# EAGLE design Grove - Recorder v1.0 (EAGLE 6.4)
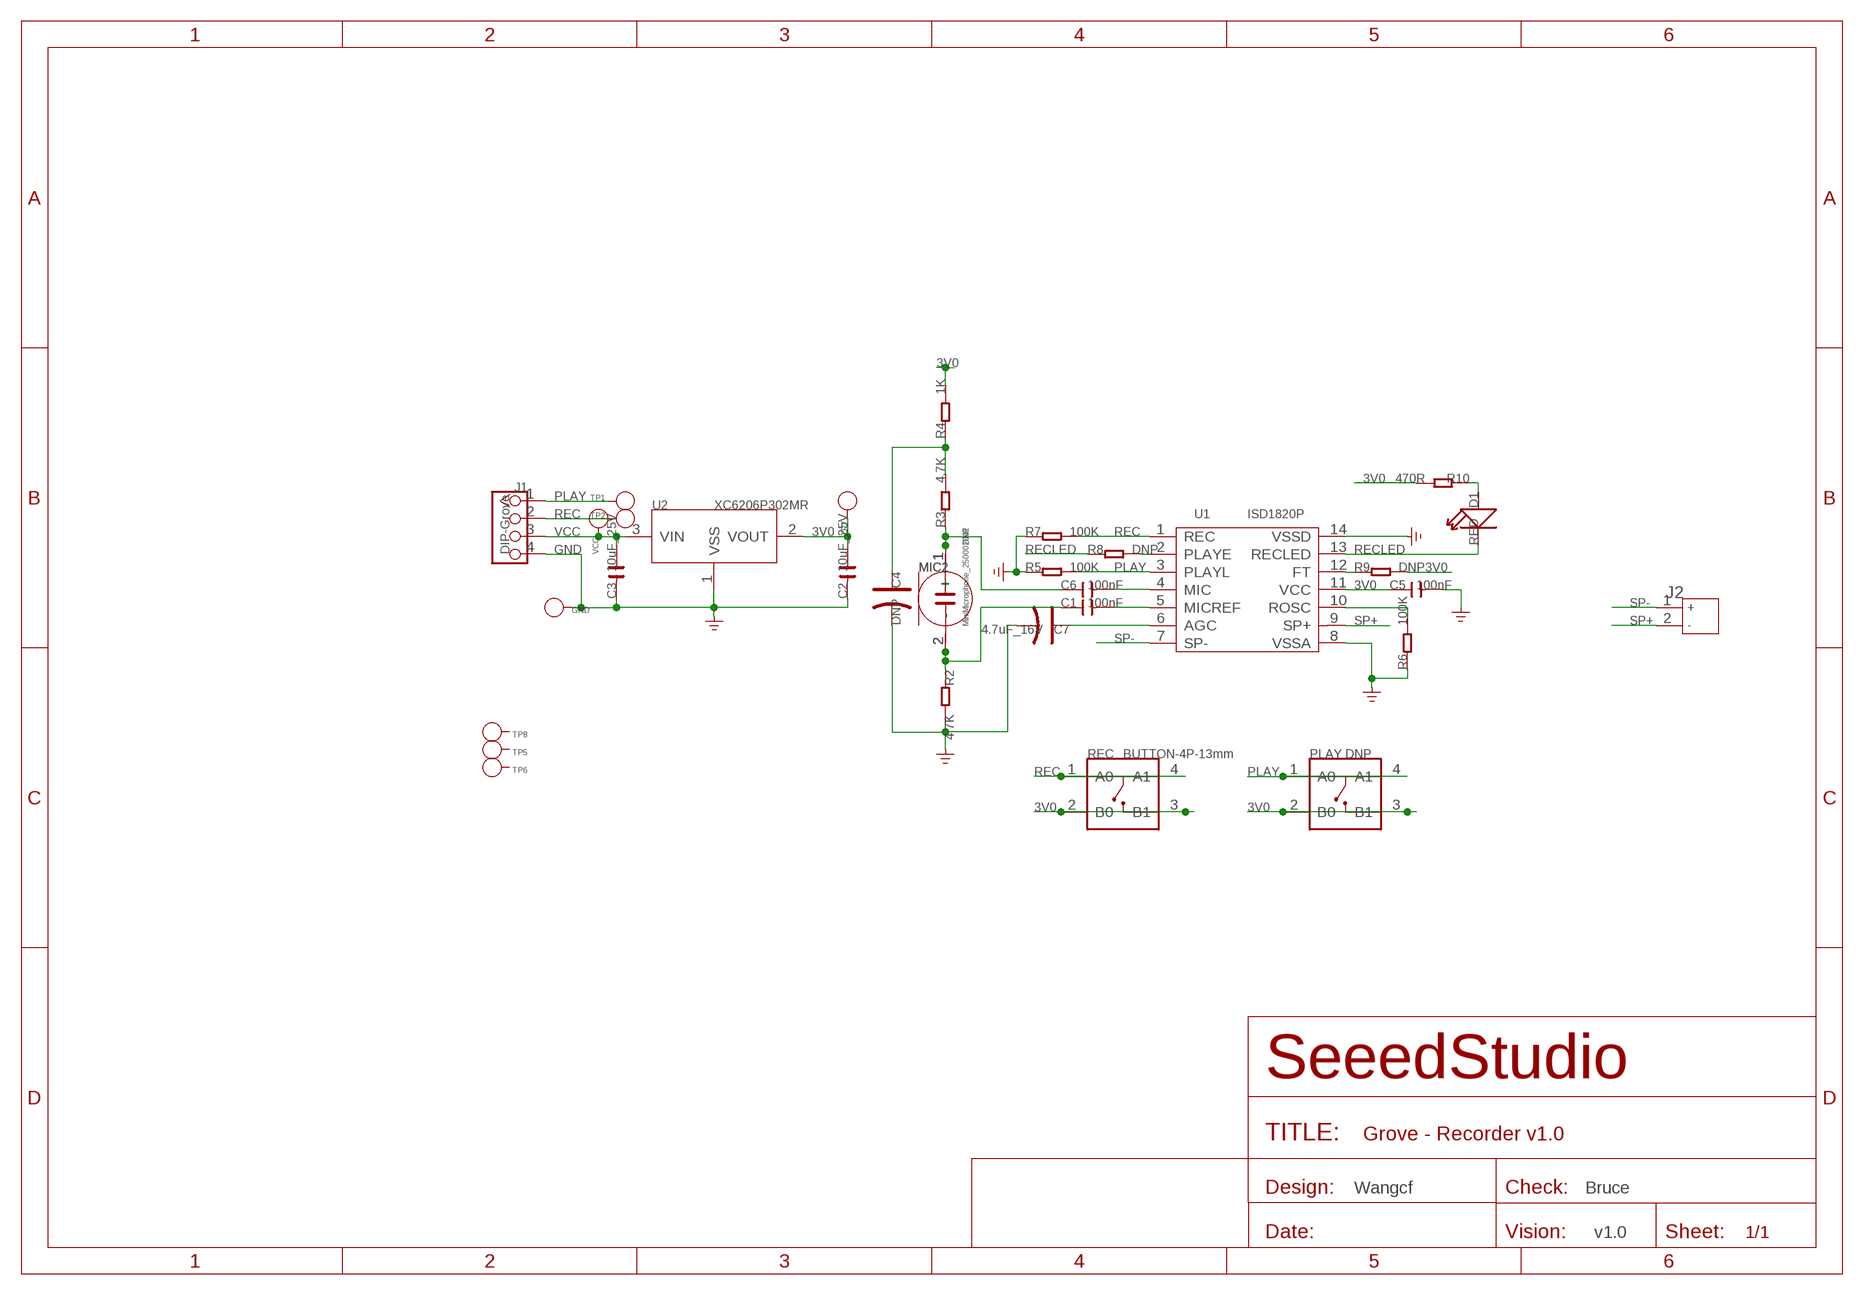
[diagram p0: schematic, sheet 1]

## Parts
C1  100nF  C-0603  [C0603]
C2  10uF_25V  C-0805  [C0805]
C3  10uF_25V  C-0805  [C0805]
C4  DNP  CAP-AVX-A  [AVX-A]
C5  100nF  C-0603  [C0603]
C6  100nF  C-0603  [C0603]
C7  4.7uF_16V  C-POLAR-A  [AVX-A]
D1  RED  LED'RIGHT'  [LED-SIDE-VIEW-0603-RIGHT]
GND  PAD-TEST-POINT'4545'  [TP_4545]
J1  DIP-Grove  TWIG-4P-2.0-2.0  [4P-2.0]
J2  JACK-JST-2P-PW'2.0'  [JST-2.0]
MIC1  MiniMicrophone_250002001  MICROPHONE  [2P-D8.9MM]
MIC2  DNP  MICROPHONE  [2P-D8.9MM]
PLAY  DNP  BUTTON-4P-3110040P1  [4P-6.0X6.0X5.0H]
R2  4.7K  R-0603  [R0603]
R3  4.7K  R-0603  [R0603]
R4  1K  R-0603  [R0603]
R5  100K  R-0603  [R0603]
R6  100K  R-0603  [R0603]
R7  100K  R-0603  [R0603]
R8  DNP  R-0603  [R0603]
R9  DNP  R-0603  [R0603]
R10  470R  R-0603  [R0603]
REC  BUTTON-4P-13mm  BUTTON-4P-3110040P1  [4P-6.0X6.0X5.0H]
TP1  PAD-TEST-POINT'4545'  [TP_4545]
TP2  PAD-TEST-POINT'4545'  [TP_4545]
TP5  PAD-TEST-POINT'4545'  [TP_4545]
TP6  PAD-TEST-POINT'4545'  [TP_4545]
TP7  PAD-TEST-POINT'4545'  [TP_4545]
TP8  PAD-TEST-POINT'4545'  [TP_4545]
U1  ISD1820P  [DIP14]
U2  XC6206P302MR  XC6206MR  [SOT23]
VCC  PAD-TEST-POINT'4545'  [TP_4545]

## Nets
3V0: C2.2 C5.1 PLAY.2(B0) PLAY.3(B1) R4.2 R9.2 R10.2 REC.2(B0) REC.3(B1) TP7.T U1.11(VCC) U2.2(VOUT)
GND: C2.1 C3.1 C4.- C5.2 C7.- GND.T J1.4 R2.2 R5.1 R6.1 R7.1 U1.8(VSSA) U1.14(VSSD) U2.1(VSS)
N$1: R8.2 U1.2(PLAYE)
N$2: D1.1(+) R10.1
N$6: C7.+ U1.6(AGC)
N$7: C1.2 U1.5(MICREF)
N$8: C6.2 U1.4(MIC)
N$13: R9.1 U1.12(FT)
N$15: R6.2 U1.10(ROSC)
N$16: C4.+ R3.2 R4.1
N$19: C6.1 MIC1.1(+) MIC2.1(+) R3.1
N$20: C1.1 MIC1.2(-) MIC2.2(-) R2.1
PLAY: J1.1 PLAY.1(A0) PLAY.4(A1) R5.2 TP1.T U1.3(PLAYL)
REC: J1.2 R7.2 REC.1(A0) REC.4(A1) TP2.T U1.1(REC)
RECLED: D1.2(-) R8.1 U1.13(RECLED)
SP+: J2.2 U1.9(SP+)
SP-: J2.1 U1.7(SP-)
VCC: C3.2 J1.3 U2.3(VIN) VCC.T
Unconnected: TP5.T TP6.T TP8.T

## Notes on the sheet
- Wangcf | Bruce
- v1.0

## Library data of the parts
C1 C5 C6 = Discrete:C*: Ceramic Capacitors
C2 C3 = OPL:C*
C4 = Discrete:CAP*: Electrolytic Capacitors,Tantalum Capacitors and Super Capacitors
C7 = OPL:C-POLAR*
D1 = Discrete:LED*
GND TP1 TP2 TP5-TP8 VCC = Discrete:PAD-TEST-POINT; PARTNO: DNP
J1 = Connector :TWIG-4P-2.0
J2 = Connector :JACK-JST-2P-PW
MIC1 MIC2 = Discrete:MICROPHONE
PLAY REC = OPL:BUTTON-4P
R2-R10 = Discrete:R*
U1 = template:ISD1820P
U2 = IC:XC6206: LOW ESR Cap.Compatible Positive Voltage Regulators

## Net classes
0 default: width 0.152 mm, drill 0.305 mm, clearance 0.152 mm
3 none3: width 0.203 mm, drill 0.305 mm, clearance 0.203 mm

## Board
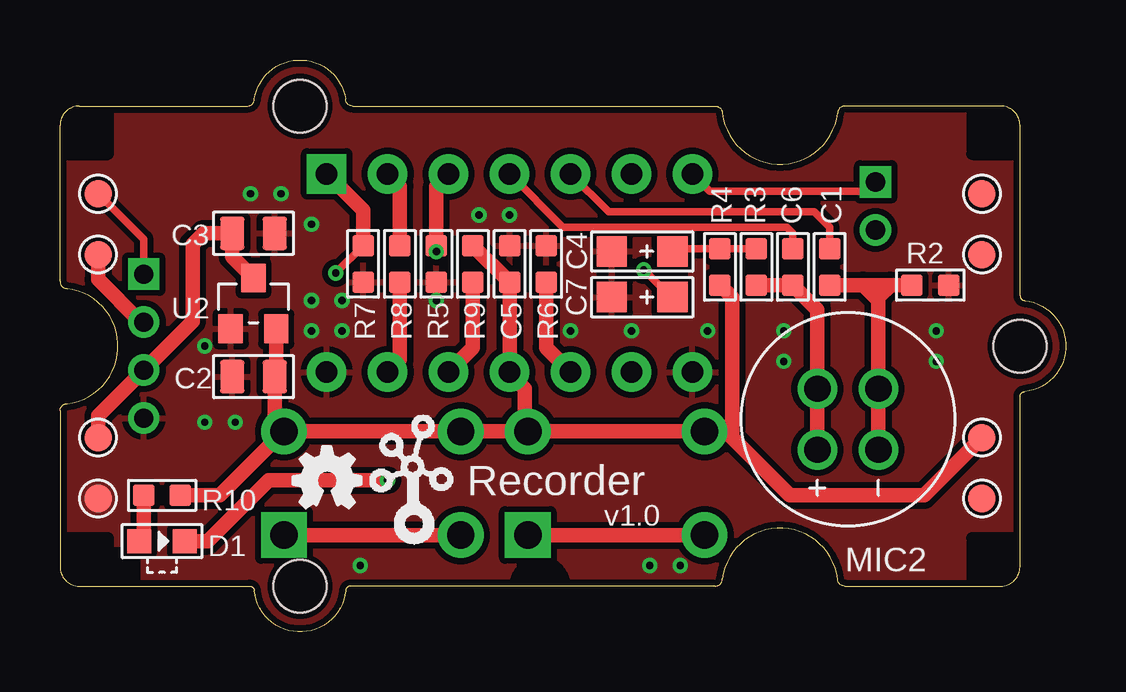
[diagram p1: board, top side]
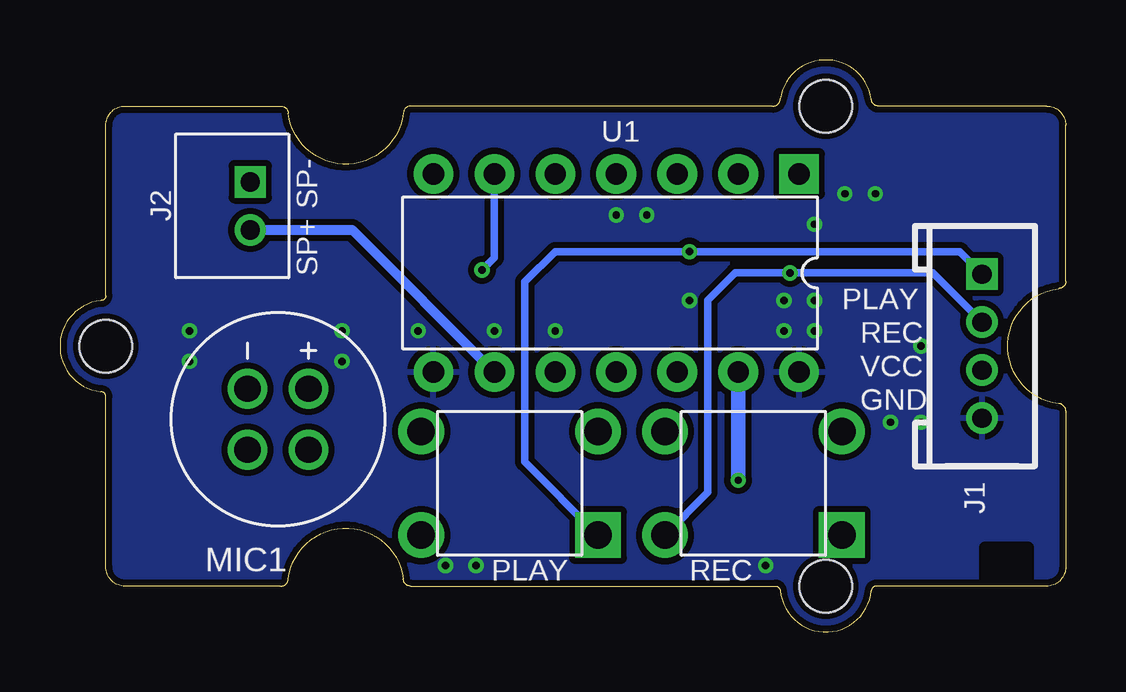
[diagram p2: board, bottom side, seen from below]

Size 41.91 x 23.83 mm. Coordinates in mm from the lower left corner, seen from the top.
Copper layers (1*16): Top 0.035mm / dielectric 1.5mm / Bottom 0.035mm
Design rules "default *": minimum track width 6mil, minimum drill 12mil, track to track 6mil, track to pad 6mil, pad to pad 6mil, via to via 6mil, smd to smd 0mil, copper to edge 10mil, drill to drill 10mil, minimum pad ring 10mil, minimum via ring 6mil, stop-mask expansion 2mil, vias tented up to drill 100mil, thermal gap 10mil
tRestrict: area 1.8,2 to 3.1,3.3
bRestrict: area 1.6,1.7 to 3.4,3.5

### Footprints (pad centres in the part's own frame; a part is rotated, then mirrored left to right if it is on the bottom)
C0603 = smd 0.889 x 0.889: 1 -0.762,0; 2 0.762,0
C0805 = smd 1.016 x 1.397: 1 -0.889,0; 2 0.889,0
AVX-A = smd 1.27 x 1.27: + -1.27,0; - 1.27,0
LED-SIDE-VIEW-0603-RIGHT = smd 1 x 1: 1 0,-0.95; 2 0,0.95
TP_4545 = smd 1.143 x 1.143: T 0,0
4P-2.0 = drill 0.8 pad 1.27 square: 1 -3,0 | drill 0.8 pad 1.27: 2 -1,0; 3 1,0; 4 3,0
JST-2.0 = drill 0.8 pad 1.3 square: 1 -1,0.75 | drill 0.8 pad 1.3: 2 1,0.75
2P-D8.9MM = drill 1.1: 1 -1.27,1.27; 2 -1.27,-1.27
4P-6.0X6.0X5.0H = drill 1.143 pad 1.905 square: 1 -3.683,2.159 | drill 1.143 pad 1.905: 2 -3.683,-2.159; 3 3.683,-2.159; 4 3.683,2.159
R0603 = smd 0.889 x 0.889: 1 -0.762,0; 2 0.762,0
DIP14 = drill 0.889 pad 1.651 square: 1 -7.62,-4 | drill 0.889 pad 1.651: 2 -5.08,-4; 3 -2.54,-4; 4 0,-4; 5 2.54,-4; 6 5.08,-4; 7 7.62,-4; 8 7.62,4.255; 9 5.08,4.255; 10 2.54,4.255; 11 0,4.255; 12 -2.54,4.255; 13 -5.08,4.255; 14 -7.62,4.255
SOT23 = smd 1.016 x 1.2: 1 -0.95,-1.06; 2 0.95,-1.06; 3 0,1.06
GROVE-2CONNECTOR = hole 2.2: -10,-10; -10,10; 20,0

### Placement (x,y rotation side)
C1  32.06,15.21 90 top
C2  8.06,10.64 0 top
C3  8.06,16.61 180 top
C4  24.26,15.85 180 top
C5  18.73,15.34 90 top
C6  30.54,15.21 90 top
C7  24.26,13.95 180 top
D1  4.25,3.78 270 top
GND  1.59,5.56 0 top
J1  3.49,11.91 270 bottom
J2  34.73,17.75 270 bottom
MIC1  32.83,8.86 270 bottom
MIC2  32.83,8.86 90 top
PLAY  23.18,6.19 180 bottom
R2  36.26,14.45 0 top
R3  29.02,15.21 90 top
R4  27.49,15.21 270 top
R5  15.68,15.34 90 top
R6  20.25,15.34 270 top
R7  12.63,15.34 90 top
R8  14.16,15.34 90 top
R9  17.21,15.34 90 top
R10  4.25,5.69 0 top
REC  13.02,6.19 180 bottom
TP1  1.59,18.26 0 top
TP2  1.59,15.72 0 top
TP5  38.41,18.26 0 top
TP6  38.41,15.72 0 top
TP7  38.41,8.1 0 top
TP8  38.41,5.56 0 top
U1  18.73,15.08 180 bottom
U2  8.06,13.69 0 top
U$9  [GROVE-2CONNECTOR]  20,11.91 0 top
U$10  [TWIGLOGO_SMALL]  12.51,3.53 0 top
U$11  [OSHW_FILLX100_NOTEXT]  9.71,5.18 0 top
VCC  1.59,8.1 0 top

### Tracks (layer width: path | path; a pad name or v marks a point on that pad's centre or on a via)
3V0
  Top 0.61: R9.2 C5.1 U1.11 18.73,10.77 19.37,10.13 19.37,8.48 PLAY.2 | U2.2 9.01,10.7 C2.2 8.95,8.73 REC.2 | PLAY.2 PLAY.3 27.62,8.35 | PLAY.2 REC.3 REC.2 | R10.2 6.67,5.69 REC.2 | 28,8.1 30.41,5.69 36,5.69 TP7.T | 28,8.1 28,8.73 | 28,8.73 28,13.94 R4.2 | 27.62,8.35 28,8.73 | 27.62,8.35 27.75,8.35 28,8.1
GND  (via drill 0.3 pad 0.64)
  other vias: 15.68,13.81 21.27,12.54 11.74,13.81 11.74,12.54 10.47,12.54 10.47,13.81 26.98,12.54 30.16,11.27 30.16,12.54 9.21,18.26 36.51,12.54 36.51,11.27 7.3,8.73 6.03,8.73 6.03,11.91 25.84,2.76 24.57,2.76 12.51,2.76 7.93,18.26 23.81,12.54 10.47,16.99 18.73,17.37 17.46,17.37
  pour Top (isolate 0.254): 42.99,24.1 -2.1,24.1 -2.1,-0.28 42.99,-0.28
  pour Bottom (isolate 0.254): -2.1,24.1 42.99,24.1 42.99,-0.28 -2.1,-0.28
N$1
  Top 0.61: R8.2 14.16,18.58 U1.2
N$2
  Top 0.61: R10.1 3.49,3.97 D1.1
N$6  (via drill 0.3 pad 0.64)
  Top 0.305: C7.+ 25.46,13.95 v24.32,15.08
  Bottom 0.305: U1.6 23.81,15.6 v24.32,15.08
N$7
  Top 0.305: U1.5 22.86,17.5 31.43,17.5 32.07,16.86 C1.2
N$8
  Top 0.305: U1.4 20.95,16.86 30.29,16.86 30.54,16.61 C6.2
N$13
  Top 0.61: R9.1 17.21,11.84 U1.12
N$15
  Top 0.61: R6.2 20.25,11.84 U1.10
N$16
  Top 0.305: 28.89,15.97 R3.2 R4.1 25.65,15.97 C4.+
N$19
  Top 0.61: MIC2.1 MIC1.1 31.56,13.43 C6.1 R3.1
N$20
  Top 0.61: MIC2.2 MIC1.2 34.1,13.81 | C1.1 33.46,14.45 | 33.46,14.45 34.61,14.45 | 34.61,14.45 R2.1 | 34.1,13.81 33.46,14.45 | 34.1,13.81 34.1,13.94 34.61,14.45
PLAY  (via drill 0.3 pad 0.64)
  Top 0.305: TP1.T 3.49,16.35 J1.1
  Top 0.61: R5.2 v15.68,15.85 15.68,18.58 U1.3 | PLAY.1 PLAY.4
  Bottom 0.305: J1.1 4.43,15.85 v15.68,15.85 21.28,15.85 22.54,14.59 22.54,7.08 PLAY.1
REC  (via drill 0.3 pad 0.64)
  Top 0.305: R7.2 v11.49,14.96
  Top 0.61: R7.2 12.63,17.56 U1.1 | REC.4 REC.1 | TP2.T 1.59,14.69 3.35,12.92 3.47,12.92 J1.2
  Bottom 0.305: J1.2 5.54,14.96 v11.49,14.96 13.78,14.96 14.93,13.81 14.93,5.82 14.92,5.81 REC.4
RECLED  (via drill 0.3 pad 0.64)
  Top 0.61: R8.1 14.16,11.34 U1.13 | D1.2 6.16,3.78 8.7,6.32 v13.65,6.32
  Bottom 0.61: v13.65,6.32 U1.13
SP+
  Bottom 0.406: U1.9 29.73,16.75 J2.2
SP-
  Top 0.305: U1.7 27.06,18.37 33.6,18.37 J2.1
VCC
  Top 0.61: U2.3 7.17,15.64 C3.2 5.98,16.61 5.52,16.15 5.52,12.94 J1.3 1.59,9 VCC.T

### Text on the board
tPlace: Recorder | v1.0
bPlace: SP- | SP+ | PLAY | REC | VCC | GND